# Altium schematic sheet MotorDriversUnit.SchDoc: Teknofest Project
size A4; SheetNumber: 4; SheetTotal: 4; Prepared by: Mustafa Oğuz ATEŞ
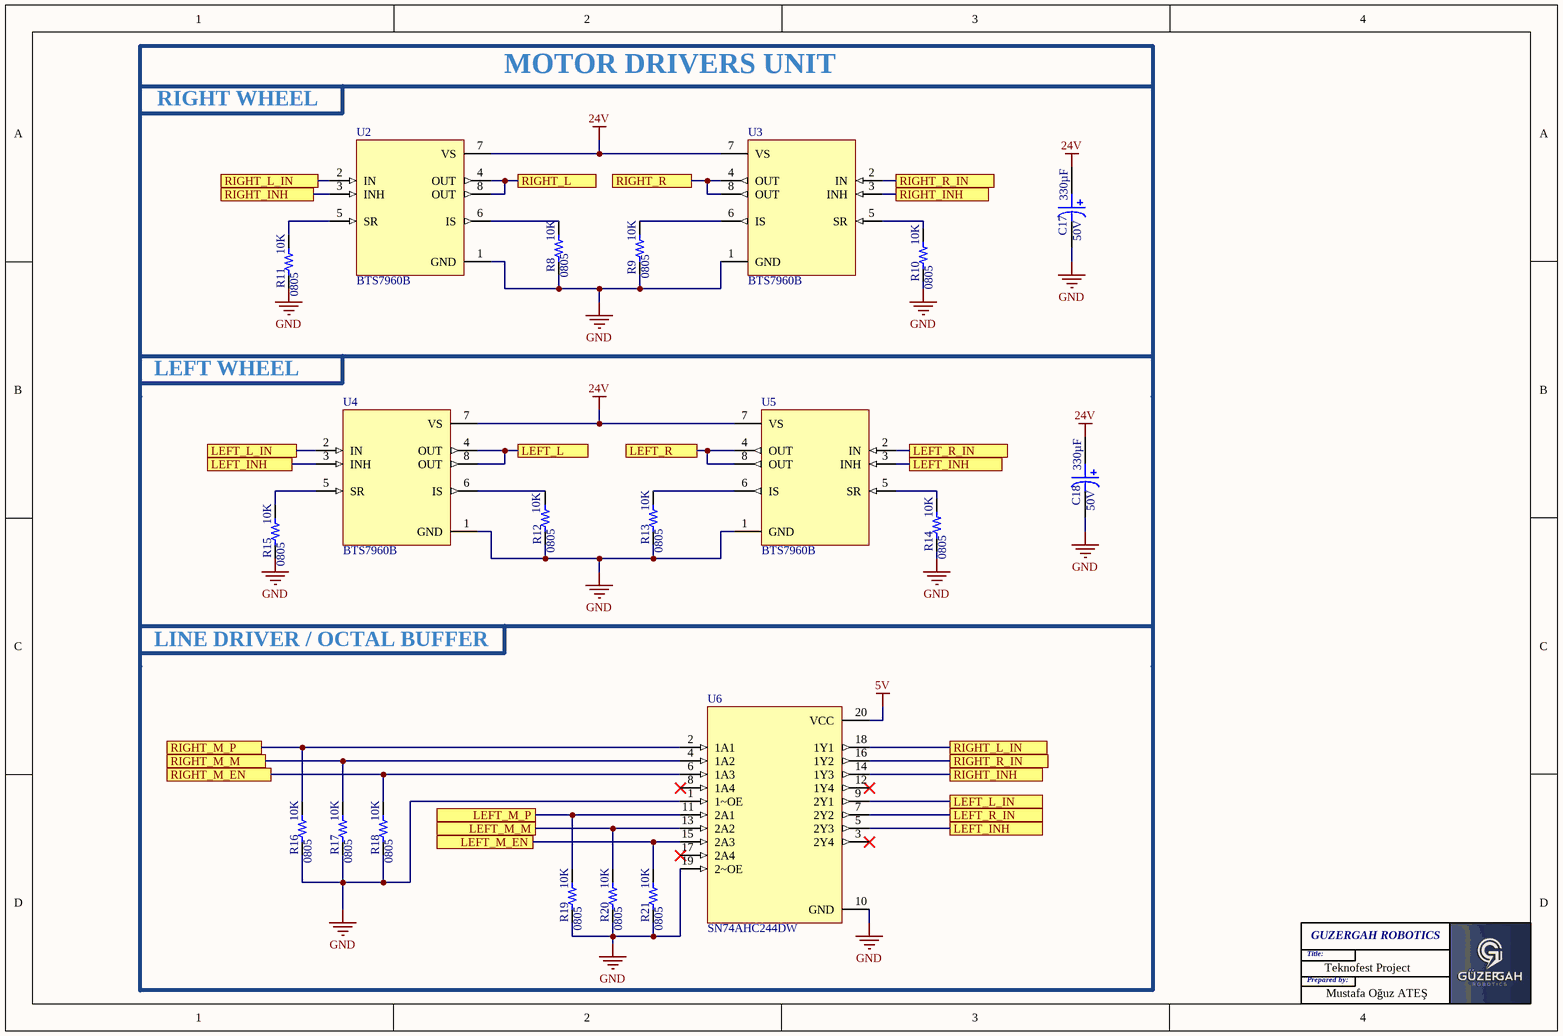
[diagram p0: MotorDriversUnit.SchDoc]

## Parts
C17  value 330µF  Voltage - Rated: 50V  [CAP_ALUM_330uF_10x17 5MM]  (hidden comment: CD11GCL-50V330-10X17)
C18  value 330µF  Voltage - Rated: 50V  [CAP_ALUM_330uF_10x17 5MM]  (hidden comment: CD11GCL-50V330-10X17)
R8  value 10K  Package / Case: 0805  [RES_0805_10K]  (hidden comment: RES_0805_10K)
R9  value 10K  Package / Case: 0805  [RES_0805_10K]  (hidden comment: RES_0805_10K)
R10  value 10K  Package / Case: 0805  [RES_0805_10K]  (hidden comment: RES_0805_10K)
R11  value 10K  Package / Case: 0805  [RES_0805_10K]  (hidden comment: RES_0805_10K)
R12  value 10K  Package / Case: 0805  [RES_0805_10K]  (hidden comment: RES_0805_10K)
R13  value 10K  Package / Case: 0805  [RES_0805_10K]  (hidden comment: RES_0805_10K)
R14  value 10K  Package / Case: 0805  [RES_0805_10K]  (hidden comment: RES_0805_10K)
R15  value 10K  Package / Case: 0805  [RES_0805_10K]  (hidden comment: RES_0805_10K)
R16  value 10K  Package / Case: 0805  [RES_0805_10K]  (hidden comment: RES_0805_10K)
R17  value 10K  Package / Case: 0805  [RES_0805_10K]  (hidden comment: RES_0805_10K)
R18  value 10K  Package / Case: 0805  [RES_0805_10K]  (hidden comment: RES_0805_10K)
R19  value 10K  Package / Case: 0805  [RES_0805_10K]  (hidden comment: RES_0805_10K)
R20  value 10K  Package / Case: 0805  [RES_0805_10K]  (hidden comment: RES_0805_10K)
R21  value 10K  Package / Case: 0805  [RES_0805_10K]  (hidden comment: RES_0805_10K)
U2  BTS7960B  [DPAK127P1490X440-8N]
U3  BTS7960B  [DPAK127P1490X440-8N]
U4  BTS7960B  [DPAK127P1490X440-8N]
U5  BTS7960B  [DPAK127P1490X440-8N]
U6  SN74AHC244DW  [SOIC-20]

## Ports
LEFT_INH, LEFT_L, LEFT_L_IN, LEFT_M_EN, LEFT_M_M, LEFT_M_P, LEFT_R, LEFT_R_IN, RIGHT_INH, RIGHT_L, RIGHT_L_IN, RIGHT_M_EN, RIGHT_M_M, RIGHT_M_P, RIGHT_R, RIGHT_R_IN

## Nets
5V: U6.20(VCC)
24V: C17.1 C18.1 U2.7(VS) U3.7(VS) U4.7(VS) U5.7(VS)
GND: C17.2 C18.2 R8.1 R9.1 R10.1 R11.1 R12.1 R13.1 R14.1 R15.1 R16.1 R17.1 R18.1 R19.1 R20.1 R21.1 U2.1(GND) U3.1(GND) U4.1(GND) U5.1(GND) U6.1(1~OE) U6.10(GND) U6.19(2~OE)
LEFT_INH: U4.3(INH) U5.3(INH) U6.5(2Y3) ; port LEFT_INH
LEFT_L: U4.4(OUT) U4.8(OUT) ; port LEFT_L
LEFT_L_IN: U4.2(IN) U6.9(2Y1) ; port LEFT_L_IN
LEFT_M_EN: R21.2 U6.15(2A3) ; port LEFT_M_EN
LEFT_M_M: R20.2 U6.13(2A2) ; port LEFT_M_M
LEFT_M_P: R19.2 U6.11(2A1) ; port LEFT_M_P
LEFT_R: U5.4(OUT) U5.8(OUT) ; port LEFT_R
LEFT_R_IN: U5.2(IN) U6.7(2Y2) ; port LEFT_R_IN
RIGHT_INH: U2.3(INH) U3.3(INH) U6.14(1Y3) ; port RIGHT_INH
RIGHT_L: U2.4(OUT) U2.8(OUT) ; port RIGHT_L
RIGHT_L_IN: U2.2(IN) U6.18(1Y1) ; port RIGHT_L_IN
RIGHT_M_EN: R18.2 U6.6(1A3) ; port RIGHT_M_EN
RIGHT_M_M: R17.2 U6.4(1A2) ; port RIGHT_M_M
RIGHT_M_P: R16.2 U6.2(1A1) ; port RIGHT_M_P
RIGHT_R: U3.4(OUT) U3.8(OUT) ; port RIGHT_R
RIGHT_R_IN: U3.2(IN) U6.16(1Y2) ; port RIGHT_R_IN
NetR8_2: R8.2 U2.6(IS)
NetR9_2: R9.2 U3.6(IS)
NetR10_2: R10.2 U3.5(SR)
NetR11_2: R11.2 U2.5(SR)
NetR12_2: R12.2 U4.6(IS)
NetR13_2: R13.2 U5.6(IS)
NetR14_2: R14.2 U5.5(SR)
NetR15_2: R15.2 U4.5(SR)

Not connected (* = marked no-connect by the designer): U6 3(2Y4)* 8(1A4)* 12(1Y4)* 17(2A4)*

## Notes on the sheet
- RIGHT WHEEL
- MOTOR DRIVERS UNIT
- LEFT WHEEL
- LINE DRIVER / OCTAL BUFFER
- Title:
- Prepared by:
- GUZERGAH ROBOTICS

## Library data of the parts
C17 C18 = CAP_ALUM_330uF_TH: CAP.EL.330UF 50V 10x17 5MM 105C
R8-R21 = RES_0805_10K: RES 0805 10K ohm
U6 = SN74AHC244DW: Buffer, Non-Inverting 2 Element 4 Bit per Element 3-State Output 20-SOIC